# Altium project SUBBOARD-phase_leg_3p_2L.PrjPcb
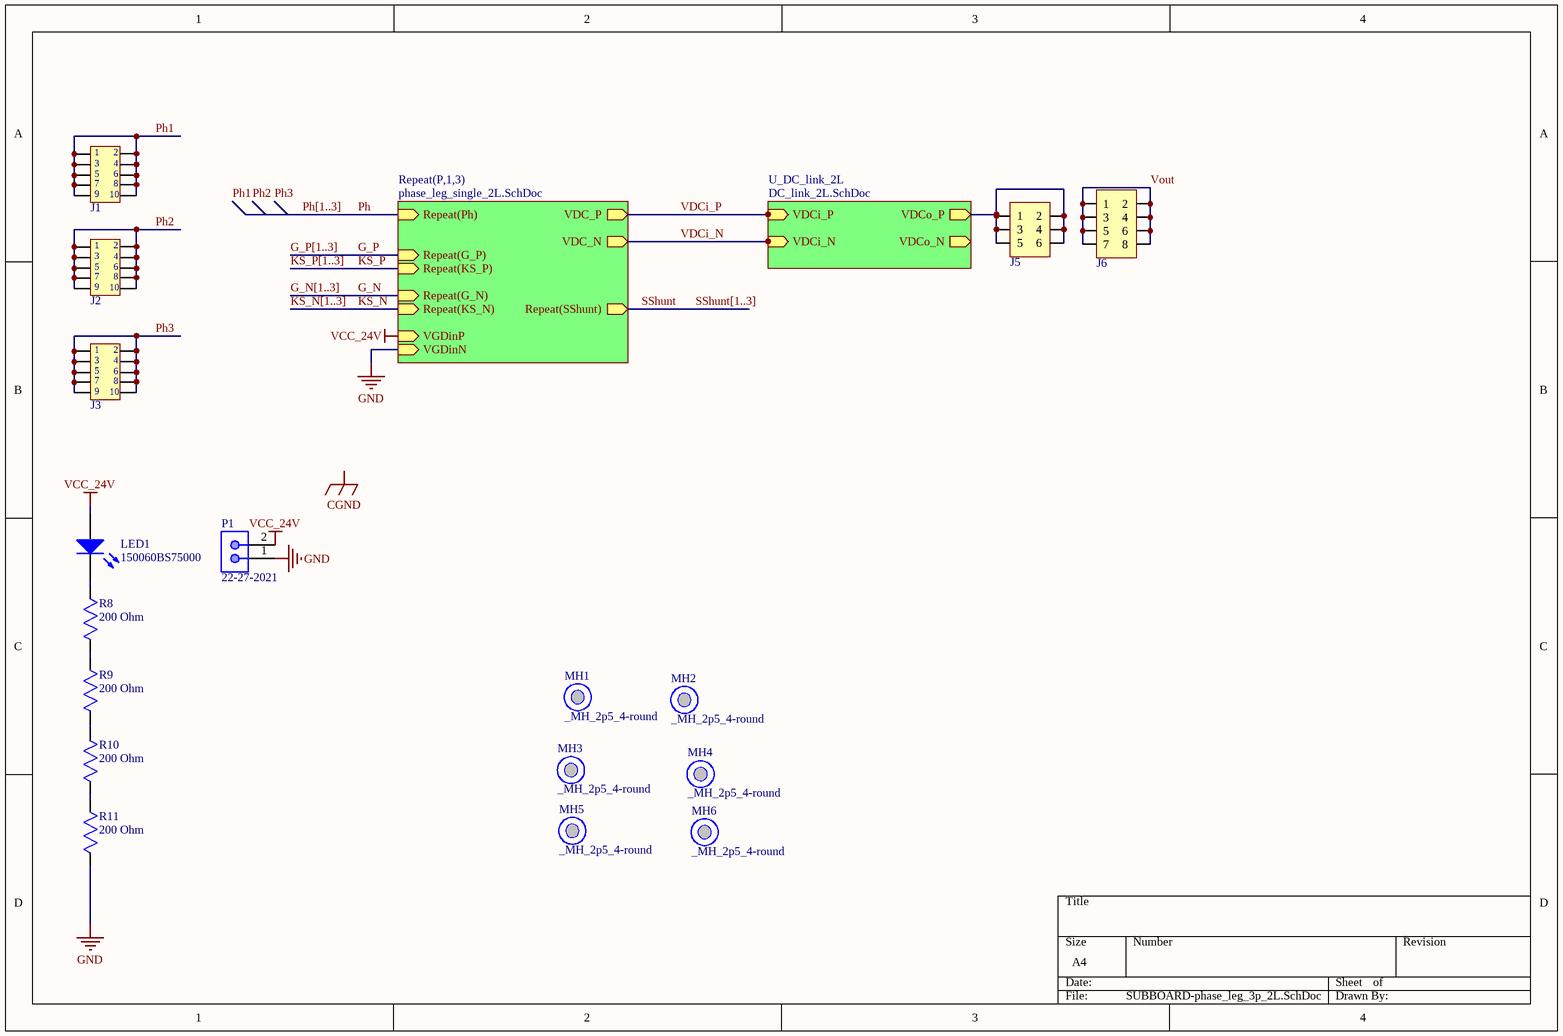
[diagram p0: SUBBOARD-phase_leg_3p_2L.SchDoc]
3 sheets, 86 parts. Net scope: hierarchical (ports join the sheet entries above them; power ports are global).
Board file: SUBBOARD-phase_leg_3p_2L.PcbDoc
Sheets:
  SUBBOARD-phase_leg_3p_2L.SchDoc
    U_DC_link_2L = DC_link_2L.SchDoc
    P1 = phase_leg_single_2L.SchDoc
    P2 = phase_leg_single_2L.SchDoc
    P3 = phase_leg_single_2L.SchDoc

## Sheet SUBBOARD-phase_leg_3p_2L.SchDoc
size A4

### Parts
J1  IPS1-105-01-L-D-RA  [IPS1-105-01-L-D-RA]  (value not drawn)
J2  IPS1-105-01-L-D-RA  [IPS1-105-01-L-D-RA]  (value not drawn)
J3  IPS1-105-01-L-D-RA  [IPS1-105-01-L-D-RA]  (value not drawn)
J5  SSW-103-01-G-D  [SSW-103-01-G-D]  (value not drawn)
J6  SSW-104-01-G-D  [SSW-104-01-G-D]  (value not drawn)
LED1  150060BS75000  [0603_A]
MH1  _MH_2p5_4-round  [_MH_2p5_4-round]
MH2  _MH_2p5_4-round  [_MH_2p5_4-round]
MH3  _MH_2p5_4-round  [_MH_2p5_4-round]
MH4  _MH_2p5_4-round  [_MH_2p5_4-round]
MH5  _MH_2p5_4-round  [_MH_2p5_4-round]
MH6  _MH_2p5_4-round  [_MH_2p5_4-round]
P1  22-27-2021  [MOLX-22-27-2021_V]
R8  200 Ohm  [CRCW0603200RFKEAHP]
R9  200 Ohm  [CRCW0603200RFKEAHP]
R10  200 Ohm  [CRCW0603200RFKEAHP]
R11  200 Ohm  [CRCW0603200RFKEAHP]

### Sub-sheets
Repeat(P,1,3) = phase_leg_single_2L.SchDoc: VDC_P (out), VDC_N (out), Repeat(Ph) (in), Repeat(G_P) (in), Repeat(KS_P) (in), Repeat(G_N) (in), Repeat(KS_N) (in), Repeat(SShunt) (out), VGDinP (in), VGDinN (in)
U_DC_link_2L = DC_link_2L.SchDoc: VDCo_P (out), VDCo_N (out), VDCi_P (in), VDCi_N (in)

### Nets
GND: P1.1 R11.2 ; sheet Repeat(P,1,3)/VGDinN
VCC_24V: LED1.2(A) P1.2 ; sheet Repeat(P,1,3)/VGDinP
G_N: sheet Repeat(P,1,3)/Repeat(G_N)
G_P: sheet Repeat(P,1,3)/Repeat(G_P)
KS_N: sheet Repeat(P,1,3)/Repeat(KS_N)
KS_P: sheet Repeat(P,1,3)/Repeat(KS_P)
Ph: sheet Repeat(P,1,3)/Repeat(Ph)
Ph1: J1.1 J1.2 J1.3 J1.4 J1.5 J1.6 J1.7 J1.8 J1.9 J1.10
Ph2: J2.1 J2.2 J2.3 J2.4 J2.5 J2.6 J2.7 J2.8 J2.9 J2.10
Ph3: J3.1 J3.2 J3.3 J3.4 J3.5 J3.6 J3.7 J3.8 J3.9 J3.10
SShunt: sheet Repeat(P,1,3)/Repeat(SShunt)
VDCi_N: sheet U_DC_link_2L/VDCo_N, sheet U_DC_link_2L/VDCi_N, sheet Repeat(P,1,3)/VDC_N
VDCi_P: J5.1 J5.2 J5.3 J5.4 J5.5 J5.6 ; sheet U_DC_link_2L/VDCo_P, sheet U_DC_link_2L/VDCi_P, sheet Repeat(P,1,3)/VDC_P
Vout: J6.1 J6.2 J6.3 J6.4 J6.5 J6.6 J6.7 J6.8
NetLED1_1: LED1.1(K) R8.1
NetR8_2: R8.2 R9.1
NetR9_2: R9.2 R10.1
NetR10_2: R10.2 R11.1

### Buses and harness runs
bus G_N[1..3]
bus G_P[1..3]
bus KS_N[1..3]
bus KS_P[1..3]
bus Ph[1..3]
bus SShunt[1..3]

### Notes on the sheet
- Labels drawn without touching a wire or pin: CGND, Ph1, Ph2, Ph3

### Library data of the parts
J1-J3 = IPS1-105-01-L-D-RA: SAMTEC         IPS1-105-01-L-D-RA             Board-To-Board Connector, Right Angle, IPS1 Series, 10 Contacts, Receptacle, 2.54 mm, Through Hole; Number of Contacts: 10; Number of Ports: 1; Max Voltage Rating (AC): 550V; Current Rating: 9A; Voltage Rating: 777V; Pitch: 2.54mm; Supplier 1: Digi-Key; Manufacturer: Samtec; Manufacturer Part Number: IPS1-105-01-L-D-RA; RoHS: Yes; Category: Connectors; Stock 1: 364; Pricing 1: 1=2.75000, 10=2.64000, 100=2.20000, 500=1.87000, 1000=1.59500, 5000=1.43000 (USD); Mount: Through Hole,Surface Mount; Number of Terminals: 10; Contact Material: Bronze; Contact Plating: Gold; Housing Material: Polymer; Min Operating Temperature: -55°C; Max Operating Temperature: 125°C; Termination: Solder; Orientation: Right Angle; Packaging: Bulk; Gender: Receptacle; Number of Rows: 2; Length: 13.08mm; Depth: 8.51mm; Radiation Hardening: No; REACH SVHC: No SVHC; ComponentLink1URL: https://datasheet.ciiva.com/25618/0900766b8114c2ed-25618027.pdf?src-supplier=RSComponents; ComponentLink1Description: https://datasheet.ciiva.com/25618/0900766b8114c2ed-25618027.pdf?src-supplier=RSComponents; ComponentLink2URL: https://datasheet.ciiva.com/9444/ipt1-9444586.pdf?src-supplier=Avnet; ComponentLink2Description: https://datasheet.ciiva.com/9444/ipt1-9444586.pdf?src-supplier=Avnet; Supplier Part Number 1: SAM9620-ND
J5 = SSW-103-01-G-D: Conn Socket Strip SKT 6 POS 2.54mm Solder ST Thru-Hole; Manufacturer: Samtec; Number of Contacts: 6; Gender: Receptacle; Connector Type: Receptacle,Socket; Contact Resistance: 10mR; Max Current Rating: 6.9A; Max Voltage Rating (AC): 550V; Mating Cycles: 100; Row Spacing: 0.1inch; Supplier 1: Digi-Key; Manufacturer Part Number: SSW-103-01-G-D; RoHS: Yes; Category: Headers and Wire Housings; Stock 1: 1397; Pricing 1: 1=0.93000, 10=0.82100, 25=0.77240, 50=0.74020, 100=0.70800, 250=0.64368, 500=0.57932 (USD); Mount: Through Hole; Contact Plating: Gold; Contact Material: Bronze; Color: Black; Housing Color: Black; Housing Material: Polymer; Min Operating Temperature: -55°C; Max Operating Temperature: 125°C; Number of Rows: 2; Termination: Solder; Packaging: Bulk; Number of Positions: 6; Orientation: Vertical; Current Rating: 6.9A; Voltage Rating: 550V; Length: 8.13mm; Pitch: 2.54mm; Depth: 4.95mm; Radiation Hardening: No; Lead Free: Lead Free; REACH SVHC: No SVHC; ComponentLink1URL: https://datasheet.ciiva.com/25617/0900766b8115c03d-25617399.pdf?src-supplier=RSComponents; ComponentLink1Description: https://datasheet.ciiva.com/25617/0900766b8115c03d-25617399.pdf?src-supplier=RSComponents; ComponentLink2URL: https://datasheet.ciiva.com/22677/82032-22677622.pdf?src-supplier=Element14; ComponentLink2Description: https://datasheet.ciiva.com/22677/82032-22677622.pdf?src-supplier=Element14; ComponentLink3URL: https://datasheet.ciiva.com/749/ssw-1xx-xx-xxx-x-xx-xxx-xx-mkt-749828.pdf?src-supplier=Digi-Key; ComponentLink3Description: https://datasheet.ciiva.com/749/ssw-1xx-xx-xxx-x-xx-xxx-xx-mkt-749828.pdf?src-supplier=Digi-Key; Supplier Part Number 1: SAM1208-03-ND; Supplier 2: Arrow; Stock 2: 1; Pricing 2: 1=0.94640, 1=0.93000, 4167=0.71590, 8334=0.59720, 41667=0.52200, 83334=0.49330 (USD); Supplier 3: Mouser; Stock 3: 388; Pricing 3: 1=1.35000, 10=1.10000, 100=0.98200, 250=0.91700, 500=0.79200, 1000=0.69000 (USD); Supplier Part Number 2: SSW-103-01-G-D; Supplier Part Number 3: 200-SSW10301GD
J6 = SSW-104-01-G-D: Conn Socket Strip SKT 8 POS 2.54mm Solder ST Thru-Hole; Manufacturer: Samtec; Number of Contacts: 8; Max Current Rating: 6.9A; Contact Resistance: 10mR; Max Voltage Rating (AC): 550V; Gender: Receptacle; Connector Type: Receptacle,Socket; Mating Cycles: 100; Row Spacing: 0.1inch; Supplier 1: Digi-Key; Manufacturer Part Number: SSW-104-01-G-D; RoHS: Yes; Category: Headers and Wire Housings; Stock 1: 1152; Pricing 1: 1=1.24000, 10=1.09400, 25=1.03000, 50=0.98700, 100=0.94410, 250=0.85824, 500=0.77242 (USD); Mount: Through Hole; Contact Plating: Gold; Contact Material: Bronze; Color: Black; Housing Color: Black; Housing Material: Polymer; Min Operating Temperature: -55°C; Max Operating Temperature: 125°C; Number of Rows: 2; Termination: Solder; Packaging: Bulk; Orientation: Vertical; Number of Positions: 8; Current Rating: 6.9A; Voltage Rating: 550V; Length: 10.67mm; Pitch: 2.54mm; Depth: 4.95mm; Radiation Hardening: No; Lead Free: Lead Free; REACH SVHC: No SVHC; ComponentLink1URL: https://datasheet.ciiva.com/25617/0900766b8115c03d-25617355.pdf?src-supplier=RSComponents; ComponentLink1Description: https://datasheet.ciiva.com/25617/0900766b8115c03d-25617355.pdf?src-supplier=RSComponents; ComponentLink2URL: https://datasheet.ciiva.com/22677/82032-22677624.pdf?src-supplier=Element14; ComponentLink2Description: https://datasheet.ciiva.com/22677/82032-22677624.pdf?src-supplier=Element14; ComponentLink3URL: https://datasheet.ciiva.com/749/ssw-1xx-xx-xxx-x-xx-xxx-xx-mkt-749827.pdf?src-supplier=Digi-Key; ComponentLink3Description: https://datasheet.ciiva.com/749/ssw-1xx-xx-xxx-x-xx-xxx-xx-mkt-749827.pdf?src-supplier=Digi-Key; Supplier Part Number 1: SAM1208-04-ND
LED1 = CMP-1426-00003-1: SMD mono-color Chip LED, WL-SMCW, Blue; Manufacturer: Wuerth Elektronik; Color: Blue; ComponentLink2Description: Datasheet; ComponentLink2URL: http://katalog.we-online.com/led/datasheet/150060BS75000.pdf; ComponentLink1URL: http://www.we-online.com; PackageReference: 0603_A; PartNumber: 150060BS75000; ComponentLink1Description: Manufacturer URL
MH1-MH6 = _MH_2p5_4-round: matching hole 2.5 hole, 4mm pad (round)
P1 = CMP-2000-05537-1: Male Header, Pitch 2.54 mm, 1 x 2 Position, Height 11.7 mm, Tail Length 3.56 mm, 0 to 75 degC, RoHS, Bulk; Manufacturer: Molex; PartNumber: 0022272021; Current rating: 4A; Package Version: Rev. BC, 02/2012; Voltage rating: 250V; No. of Positions: 2; Pitch: 2.54mm; No. of Rows: 1; Orientation: Vertical; Operating temperature: 0°Cto+75°C; Manufacturer URL: http://www.molex.com/; Mounting Technology: ThroughHole; Housing material: Nylon(UL94V-0); Package Description: 2-Leads Header, Body 5.08 x 5.8 mm, Pitch 2.54 mm; Voltage - Max: 250V; Datasheet URL: http://www.molex.com/pdm_docs/sd/022272021_sd.pdf; Package Reference: 22-27-2021; Contact material: Tinplatedbrass; Current - Max: 4A; Datasheet Version: Rev. F, 06/2009
R8-R11 = CRCW0603200RFKEAHP: CRCW0603200RFKEAHP / Res Thick Film 0603 200 Ohm 1% 0.25W(1/4W) ±100ppm/C Pad SMD Automotive T/R; Manufacturer: Vishay Dale; Resistance: 200R; Power Rating: 250mW; Temperature Coefficient: 100ppm/°C; Supplier 1: Digi-Key; Manufacturer Part Number: CRCW0603200RFKEAHP; RoHS: Yes; Category: Chip SMD Resistors; Stock 1: 59007; Pricing 1: 1=0.15000, 10=0.12900, 100=0.05030, 1000=0.02106, 2500=0.01930 (USD); Mount: Surface Mount; Case/Package: 0603; Case Code (Imperial): 0603; Case Code (Metric): 1608; Contact Plating: Tin; Min Operating Temperature: -55°C; Max Operating Temperature: 155°C; Features: Automotive AEC-Q200; Tolerance: 1%; Packaging: Tape and Reel; Resistor Type: Thick Film; Max Power Dissipation: 250mW; Number of Terminations: 2; Package Quantity: 5000; Length: 0.063inch; Width: 0.033inch; Height: 0.022inch; Radiation Hardening: No; Lead Free: Lead Free; ComponentLink1URL: https://datasheet.ciiva.com/2578/crcwhpe3-2578537.pdf?src-supplier=Digi-Key; ComponentLink1Description: https://datasheet.ciiva.com/2578/crcwhpe3-2578537.pdf?src-supplier=Digi-Key; ComponentLink2URL: https://datasheet.ciiva.com/8961/crcwhpe3-8961129.pdf?src-supplier=Avnet; ComponentLink2Description: https://datasheet.ciiva.com/8961/crcwhpe3-8961129.pdf?src-supplier=Avnet; Supplier Part Number 1: 541-200SCT-ND

## Sheet DC_link_2L.SchDoc
size A4
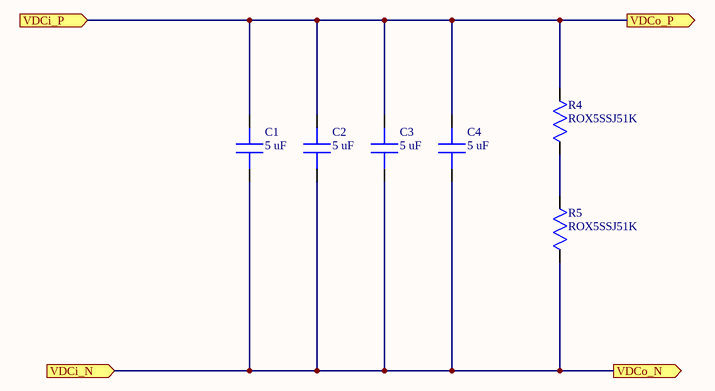
[diagram p1: DC_link_2L.SchDoc]

### Parts
C1  Capacitance: 5 uF  [MKP1848S55010JP4B]  (hidden comment: MKP1848S55010JP4B)
C2  Capacitance: 5 uF  [MKP1848S55010JP4B]  (hidden comment: MKP1848S55010JP4B)
C3  Capacitance: 5 uF  [MKP1848S55010JP4B]  (hidden comment: MKP1848S55010JP4B)
C4  Capacitance: 5 uF  [MKP1848S55010JP4B]  (hidden comment: MKP1848S55010JP4B)
R4  ROX5SSJ51K  [RES_ROX5SS]
R5  ROX5SSJ51K  [RES_ROX5SS]

### Ports
VDCi_N (in), VDCi_P (in), VDCo_N (out), VDCo_P (out)

### Nets
VDCi_N: C1.2 C2.2 C3.2 C4.2 R5.1 ; port VDCo_N, port VDCi_N
VDCi_P: C1.1 C2.1 C3.1 C4.1 R4.2 ; port VDCo_P, port VDCi_P
NetR4_1: R4.1 R5.2

### Library data of the parts
C1-C4 = MKP1848S55010JP4B: Film Capacitors 5uF 5% 1000volts 4pins 37.5mm LS; Manufacturer: Vishay; Voltage Rating DC: 1000 V; ESR: 11.5 mOhm; Tolerance: 5 %; Number of Pins: 4; Supplier 1: Mouser; Supplier Part Number 1: 75-MKP1848S55010JP4B
R4 R5 = ROX5SSJ51K: Metal Oxide Resistors 5W XSM M/OX 5% 51K; Manufacturer: TE Connectivity; Value: 51 kOhm; Manufacturer Part Number: ROX5SSJ51K; RoHS: No; Stock 1: 846; Pricing 1: 1=0,66000, 10=0,54900, 25=0,47080, 50=0,42360, 100=0,36880, 250=0,32952 (USD); Power: 5 W; Tolerance: 5 %; Length: 17.5 mm; Diameter: 6.5 mm; Supplier 1: Digi-Key; Supplier 2: Digi-Key; Supplier 3: RSComponents; Supplier 4: Mouser; Supplier 5: Farnell; Supplier Part Number 5: 3229952; Supplier Part Number 4: 279-ROX5SSJ51K; Supplier Part Number 3: 1869581; Supplier Part Number 2: A142841TB-ND; Supplier Part Number 1: A142841CT-ND

## Sheet phase_leg_single_2L.SchDoc
size A4
Used 3 times, as channels P1, P2, P3. Parts and nets are listed once, with the designators drawn on the sheet.
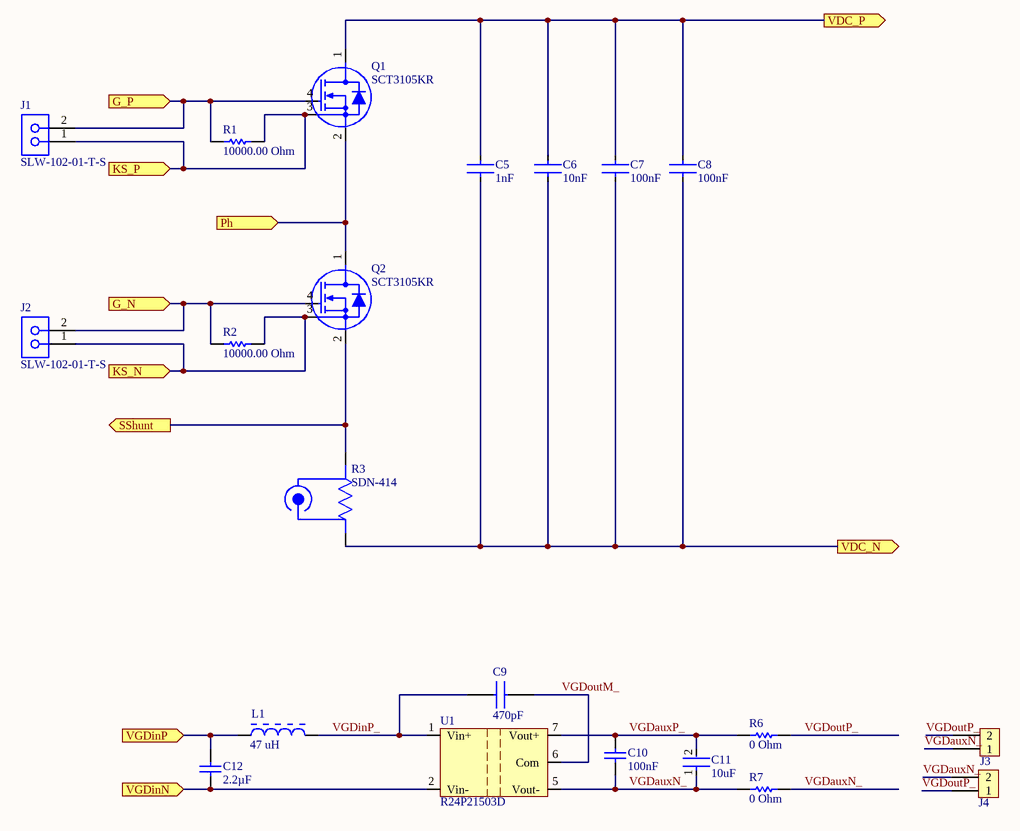
[diagram p2: phase_leg_single_2L.SchDoc]

### Parts
C5  Capacitance: 1nF  [C_2220_L_C2220C102JGGACTU]  (hidden comment: C2220C102JGGACTU)
C6  Capacitance: 10nF  [C_2220_L_C2220C103KDRACTU]  (hidden comment: C2220C103KDRACTU)
C7  Capacitance: 100nF  [C_2220_L_C2220C104KDRACTU]  (hidden comment: C2220C104KDRACTU)
C8  Capacitance: 100nF  [C_2220_L_C2220C104KDRACTU]  (hidden comment: C2220C104KDRACTU)
C9  Capacitance: 470pF  [885352211001]  (hidden comment: 885352211001)
C10  value 100nF  [CAPC0603(1608)100_L]  (hidden comment: CAP 100nF 50V 0603(1608))
C11  value 10uF  [FP-GRT31-0_2-MFG]  (hidden comment: GRT31CR61H106KE01L)
C12  Capacitance: 2.2µF  [CAPC2013X145X20LL20]  (hidden comment: C2012X7R1H225K125AC)
J1  SLW-102-01-T-S  [SMTC-SLW-102-01-X-S]
J2  SLW-102-01-T-S  [SMTC-SLW-102-01-X-S]
J3  SSM-102-L-SV  [SSM-102-L-SV]  (value not drawn)
J4  SSM-102-L-SV  [SSM-102-L-SV]  (value not drawn)
L1  Inductance: 47 uH  [BOUR-SRN3015-2_V]  (hidden comment: SRN3015-470M)
Q1  SCT3105KR  [TO-247-4L_hsa]
Q2  SCT3105KR  [TO-247-4L_hsa]
R1  value 10000.00 Ohm  [RESC0805(2012)_L]  (hidden comment: 10K 5% 0805(2012))
R2  value 10000.00 Ohm  [RESC0805(2012)_L]  (hidden comment: 10K 5% 0805(2012))
R3  SDN-414  [SDN-414]
R6  value 0 Ohm  [RESC2013X50X30LL20T20]  (hidden comment: CRCW08050000Z0EA)
R7  value 0 Ohm  [RESC2013X50X30LL20T20]  (hidden comment: CRCW08050000Z0EA)
U1  R24P21503D  [SIP-7_R05P22005D]

### Ports
G_N (in), G_P (in), KS_N (in), KS_P (in), Ph (in), SShunt (out), VDC_N (out), VDC_P (out), VGDinN (in), VGDinP (in)

### Nets
G_N: J2.2 Q2.4(G) R2.2 ; port G_N
G_P: J1.2 Q1.4(G) R1.1 ; port G_P
KS_N: J2.1 Q2.3(KS) R2.1 ; port KS_N
KS_P: J1.1 Q1.3(KS) R1.2 ; port KS_P
Ph: Q1.2(S) Q2.1(D) ; port Ph
SShunt: Q2.2(S) R3.1(-) ; port SShunt
VDC_N: C5.1 C6.1 C7.1 C8.1 R3.2(+) ; port VDC_N
VDC_P: C5.2 C6.2 C7.2 C8.2 Q1.1(D) ; port VDC_P
VGDauxN_: C10.1 C11.1 J3.1 J4.2 R7.1 R7.2 U1.5(Vout-)
VGDauxP_: C10.2 C11.2 R6.2 U1.7(Vout+)
VGDinN: C12.2 U1.2(Vin-) ; port VGDinN
VGDinP: C12.1 L1.1 ; port VGDinP
VGDinP_: C9.2 L1.2 U1.1(Vin+)
VGDoutM_: C9.1 U1.6(Com)
VGDoutP_: J3.2 J4.1 R6.1

### Channels
P1: designators end in _P1; ports G_N=G_N1 G_P=G_P1 KS_N=KS_N1 KS_P=KS_P1 Ph=Ph1 SShunt=SShunt1 VDC_N=VDCi_N VDC_P=VDCi_P VGDinN=GND VGDinP=VCC_24V
P2: designators end in _P2; ports G_N=G_N2 G_P=G_P2 KS_N=KS_N2 KS_P=KS_P2 Ph=Ph2 SShunt=SShunt2 VDC_N=VDCi_N VDC_P=VDCi_P VGDinN=GND VGDinP=VCC_24V
P3: designators end in _P3; ports G_N=G_N3 G_P=G_P3 KS_N=KS_N3 KS_P=KS_P3 Ph=Ph3 SShunt=SShunt3 VDC_N=VDCi_N VDC_P=VDCi_P VGDinN=GND VGDinP=VCC_24V

### Library data of the parts
C5 = C2220C102JGGACTU: KEMET - C2220C102JGGACTU - KONDENSATOR 1000PF 2 KV 5% C0G/NP0 2220; Dielectric Material: Ceramic; Voltage Rating (DC): 2kV; Dielectric: C0G; Temperature Coefficient: 30ppm/°C; Manufacturer: KEMET; Manufacturer Part Number: C2220C102JGGACTU; RoHS: Yes; Category: Ceramic Capacitors; Stock 1: 706; Pricing 1: 1=4,95000, 10=4,45600, 50=3,86220, 100=3,36710, 500=2,77292 (USD); Mount: Surface Mount; Case/Package: 2220; Case Code (Imperial): 2220; Case Code (Metric): 5750; Min Operating Temperature: -55°C; Max Operating Temperature: 125°C; Tolerance: 5%; Voltage Rating: 2kV; Packaging: Cut Tape; Package Quantity: 1; Length: 0.224inch; Thickness: 0.071inch; Depth: 5mm; Width: 0.197inch; Lead Free: Lead Free; REACH SVHC: No SVHC; ComponentLink1URL: https://datasheet.ciiva.com/5904/1698768-5904864.pdf?src-supplier=Farnell; ComponentLink1Description: https://datasheet.ciiva.com/5904/1698768-5904864.pdf?src-supplier=Farnell; ComponentLink2URL: https://datasheet.ciiva.com/7807/1698768-7807429.pdf?src-supplier=Element14; ComponentLink2Description: https://datasheet.ciiva.com/7807/1698768-7807429.pdf?src-supplier=Element14; ComponentLink3URL: https://datasheet.ciiva.com/7807/1698768-7807430.pdf?src-supplier=Element14; ComponentLink3Description: https://datasheet.ciiva.com/7807/1698768-7807430.pdf?src-supplier=Element14; Supplier 1: Digi-Key; Supplier 2: Digi-Key; Supplier 3: Newark; Supplier 4: Mouser; Supplier 5: Arrow; Supplier 6: Newark; Supplier 7: Farnell; Supplier Part Number 7: 1702176; Supplier Part Number 6: 67R5592; Supplier Part Number 5: C2220C102JGGACTU; Supplier Part Number 4: 80-C2220C102JGG; Supplier Part Number 3: 08R5595; Supplier Part Number 2: 399-7308-6-ND; Supplier Part Number 1: 399-7308-1-ND
C6 = C2220C103KDRACTU: Cap Ceramic 0.01uF 1000V X7R 10% SMD 2220 125C Plastic T/R; Manufacturer: KEMET; Voltage Rating: 1kV; Manufacturer Part Number: C2220C103KDRACTU; RoHS: Yes; Category: Ceramic Capacitors; Stock 1: 4957; Pricing 1: 1=4,39000, 10=3,54400, 50=3,04760, 100=2,76400, 500=2,05532 (USD); Mount: Surface Mount; Case/Package: 2220; Case Code (Imperial): 2220; Case Code (Metric): 5750; Dielectric Material: Ceramic; Min Operating Temperature: -55°C; Max Operating Temperature: 125°C; Dielectric: X7R; Package Quantity: 1; Tolerance: 10%; Packaging: Cut Tape; Voltage Rating (DC): 1kV; Length: 0.224inch; Height: 1.4mm; Thickness: 0.061inch; Depth: 5mm; Width: 0.197inch; REACH SVHC: No SVHC; ComponentLink1URL: https://datasheet.ciiva.com/7807/1499186-7807431.pdf?src-supplier=Element14; ComponentLink1Description: https://datasheet.ciiva.com/7807/1499186-7807431.pdf?src-supplier=Element14; ComponentLink2URL: https://datasheet.ciiva.com/7807/1499186-7807432.pdf?src-supplier=Element14; ComponentLink2Description: https://datasheet.ciiva.com/7807/1499186-7807432.pdf?src-supplier=Element14; Supplier 1: Digi-Key; Supplier 2: Digi-Key; Supplier 3: Digi-Key; Supplier 4: Newark; Supplier 5: Mouser; Supplier 6: Arrow; Supplier 7: Farnell; Supplier Part Number 7: 1702182; Supplier Part Number 6: C2220C103KDRACTU; Supplier Part Number 5: 80-C2220C103KDR; Supplier Part Number 4: 08R5596; Supplier Part Number 3: 399-7309-2-ND; Supplier Part Number 2: 399-7309-6-ND; Supplier Part Number 1: 399-7309-1-ND
C7 C8 = C2220C104KDRACTU: CAP CER 0.1UF 1KV X7R 2220; Manufacturer: KEMET; Dielectric Material: Ceramic; Tolerance: 10%; Manufacturer Part Number: C2220C104KDRACTU; RoHS: Yes; Category: Ceramic Capacitors; Stock 1: 1165; Pricing 1: 1=1,15000, 10=0,90600, 50=0,78500, 100=0,67940 (USD); Mount: Surface Mount; Case/Package: 2220; Case Code (Metric): 5750; Case Code (Imperial): 2220; Min Operating Temperature: -55°C; Max Operating Temperature: 125°C; Termination: SMD/SMT; Package Quantity: 500; Packaging: Tape and Reel; Voltage Rating: 1kV; Voltage Rating (DC): 1kV; Dielectric: X7R; Length: 0.224inch; Thickness: 0.087inch; Width: 0.197inch; ComponentLink1URL: http://www.farnell.com/datasheets/2316241.pdf?src-supplier=Farnell; ComponentLink1Description: http://www.farnell.com/datasheets/2316241.pdf?src-supplier=Farnell; ComponentLink2URL: http://www.mouser.com/ds/2/212/KEM_C1010_X7R_HV_SMD-345925.pdf?src-supplier=Mouser; ComponentLink2Description: http://www.mouser.com/ds/2/212/KEM_C1010_X7R_HV_SMD-345925.pdf?src-supplier=Mouser; ComponentLink3URL: http://www.kemet.com/docfinder?Partnumber=C2220C104KDRACTU&src-supplier=Digi-Key; ComponentLink3Description: http://www.kemet.com/docfinder?Partnumber=C2220C104KDRACTU&src-supplier=Digi-Key; ComponentLink4URL: https://api.kemet.com/component-edge/download/datasheet/C2220C104KDRACTU.pdf?src-supplier=Digi-Key; ComponentLink4Description: https://api.kemet.com/component-edge/download/datasheet/C2220C104KDRACTU.pdf?src-supplier=Digi-Key; ComponentLink5URL: http://www.kemet.com/Lists/ProductCatalog/Attachments/53/KEM_C1002_X7R_SMD.pdf?src-supplier=Avnet; ComponentLink5Description: http://www.kemet.com/Lists/ProductCatalog/Attachments/53/KEM_C1002_X7R_SMD.pdf?src-supplier=Avnet; Supplier 1: Digi-Key; Supplier 2: Digi-Key; Supplier 3: Digi-Key; Supplier 4: Avnet; Supplier 5: Mouser; Supplier 6: Newark; Supplier 7: Arrow; Supplier 8: Farnell; Supplier Part Number 1: 399-10490-1-ND; Supplier Part Number 2: 399-10490-6-ND; Supplier Part Number 3: 399-10490-2-ND; Supplier Part Number 4: C2220C104KDRACTU; Supplier Part Number 5: 80-C2220C104KDR; Supplier Part Number 6: 05AC8309; Supplier Part Number 7: C2220C104KDRACTU; Supplier Part Number 8: 2676644
C9 = 885352211001: CAP CER 470PF 250VAC X7R 1812; Manufacturer: Wurth Electronics; Tolerance: 10%; Ratings: X1,Y2; Manufacturer Part Number: 885352211001; RoHS: Yes; Category: Ceramic Capacitors; Stock 1: 1066; Pricing 1: 1=0,74000, 25=0,73600, 50=0,60400, 100=0,51200, 250=0,43700, 500=0,36700 (USD); Mount: Surface Mount; Case/Package: 1812; Case Code (Imperial): 1812; Case Code (Metric): 4532; Min Operating Temperature: -55°C; Max Operating Temperature: 125°C; Packaging: Cut Tape; Length: 0.177inch; Width: 0.125inch; Thickness: 0.071inch; ComponentLink1URL: https://katalog.we-online.de/pbs/datasheet/885352211001.pdf?src-supplier=Digi-Key; ComponentLink1Description: https://katalog.we-online.de/pbs/datasheet/885352211001.pdf?src-supplier=Digi-Key; Supplier 1: Mouser; Supplier 2: Digi-Key; Supplier 3: Digi-Key; Supplier 4: Digi-Key; Supplier Part Number 2: 732-8853522110011CT-ND; Supplier Part Number 3: 732-8853522110011DKR-ND; Supplier Part Number 4: 732-8853522110011TR-ND; Supplier Part Number 1: 710-885352211001
C10 = CMP-1035-02591-1: CAP 100nF 50V ±5% 0603 (1608 Metric) Thickness 1mm SMD; Tolerance: Â±5%; Case-Metric: 1608; Case-EIA: 0603; Rated Voltage: 50 V; Max Thickness: 1 mm; Technology: SMT
C11 = CMP-06035-000076-1: CAP CER 10UF 50V X5R 1206; Manufacturer: Murata; Temperature Coefficient: 15%; Tolerance: 10%; Material: Ceramic; Automotive Grade: Grade 3; Height: 1.8mm; Ipc Land Pattern Name: CAPC320160X160; Octopart: https://octopart.com/grt31cr61h106ke01l-murata-62921736; Digikey Description: CAP CER 10UF 50V X5R 1206; Voltage Rating: 50V; Device Class L3: Ceramic Capacitors; ComponentLink2URL: https://search.murata.co.jp/Ceramy/image/img/A01X/G101/ENG/GRT31CR61H106KE01-01.pdf; Device Class L1: Passive Components; Temperature Range High: +85°C; Lead Free: Yes; Capacitance: 10uF; Manufacturer Part Number: GRT31CR61H106KE01L; Temperature Range Low: -55°C; Temperature Characteristic: X5R; Category: Cap; Automotive: Yes; ComponentLink2Description: Datasheet; Device Class L2: Capacitors; Package: GRT31-0.2; RoHS: TRUE; Temperature: -55°C to +85°C
C12 = CMP-2000-06040-1: Chip Capacitor, 2.2 uF, +/- 10%, 50 V, -55 to 125 degC, 0805 (2012 Metric), RoHS, Tape and Reel; Manufacturer: TDK; PCN Part Number: MLCCPartNumberChange30/Nov/2012; Other Names: 445-5968-1; Temperature Coefficient: X7R; Catalog Drawings: CSERIES_2012-0805_1.45; Kits: 445-9015-KIT-ND-KITMLCC1000PF-47UF080510-50V445-9003-KIT-ND-KITCAPCERHICAPMLCCSMD445-173086-KIT-ND-C0402-2220X7R6.3-50V1,000PF-; Online Catalog: CSeries,GeneralPurpose; Voltage - Rated: 50V; Product Training Modules: CSeriesGeneralApplicationsSEAT,CCV,andTVCLDesignToolsGuidetoReplacinganElectrolyticCapacitorwithanMLCC; Operating Temperature: -55°C~125°C; Features: -; Tolerance: ±10%; Datasheet URL: https://datasheet.ciiva.com/24216/c2012x7r1h225k125ac-265016-24216364.pdf; Lead Style: -; Size / Dimension: 0.079"Lx0.049"W(2.00mmx1.25mm); Mounting Technology: SurfaceMount; Package Reference: 0805; Thickness (Max): 0.057"(1.45mm); RoHS Information: RoHSCertificate-MLCC; Height - Seated (Max): -; Manufacturer URL: http://www.tdk.com/; Standard Package: 1; Category: Capacitors; Package Description: 2-Pin Surface Mount Device, Body 2 x 1.25 mm; Packaging: CutTape(CT); Series: C; Applications: GeneralPurpose; Package / Case: 0805(2012Metric); Ratings: -; Datasheet Version: 09/2013; Family: CeramicCapacitors; Mounting Type: SurfaceMount,MLCC; Lead Spacing: -
J1 J2 = CMP-1023-00124-1: Low Profile Socket Strips, Through-hole, Vertical, -55 to 105 degC, 2.54 mm Pitch, 2-Pin, Female, RoHS; Manufacturer: Samtec; Pitch: 2.54 mm; System: Connector; ComponentLink2Description: Datasheet; PackageReference: SLW-102-01-X-S; Orientation: Vertical; PartNumber: SLW-102-01-T-S; ComponentLink3URL: http://www.samtec.com/documents/webfiles/cpdf/SLW-1XX-01-X-X-MKT.pdf; DatasheetVersion: F-214; Mounting Technology: Through-hole; ComponentLink3Description: Package Specification; ComponentLink2URL: http://www.samtec.com/documents/webfiles/pdf/SLW.PDF; PackageDescription: Low Profile Socket Strip; Temperature Range: -55 to 105 degC; ComponentLink1Description: Manufacturer URL; PackageVersion: X, 9/1987; RoHS: True; ComponentLink1URL: http://www.samtec.com
J3 J4 = SSM-102-L-SV: SAMTEC - SSM-102-L-SV - RECEPTACLE, 2.54MM, VERT, 2WAY; Number of Contacts: 2; Contact Resistance: 10mR; Max Voltage Rating (AC): 475V; Max Current Rating: 6.9A; Connector Type: Receptacle,Socket; System: Connector; Supplier 1: Digi-Key; Manufacturer: Samtec; Manufacturer Part Number: SSM-102-L-SV; RoHS: Yes; Category: Headers and Wire Housings; Stock 1: 51; Pricing 1: 1=0.56000, 10=0.52100, 25=0.46920, 50=0.41700, 100=0.39960, 250=0.36488, 500=0.34752 (USD); Mount: Surface Mount; Contact Plating: Gold; Contact Material: Bronze; Housing Material: Polymer; Housing Color: Black; Color: Black; Min Operating Temperature: -55°C; Max Operating Temperature: 125°C; Termination: Solder; Number of Rows: 1; Packaging: Bulk; Gender: Receptacle; Orientation: Straight; Current Rating: 6.9A; Number of Positions: 2; Voltage Rating: 475V; Voltage Rating (AC): 475V; Length: 5.08mm; Pitch: 2.54mm; Depth: 2.54mm; Lead Pitch: 2.54mm; Radiation Hardening: No; Lead Free: Lead Free; REACH SVHC: No SVHC; ComponentLink1URL: https://datasheet.ciiva.com/25617/0900766b811594ab-25617394.pdf?src-supplier=RSComponents; ComponentLink1Description: https://datasheet.ciiva.com/25617/0900766b811594ab-25617394.pdf?src-supplier=RSComponents; ComponentLink2URL: https://datasheet.ciiva.com/746/ssm-1xx-xxx-xx-xx-xx-x-xx-xx-mkt-746741.pdf?src-supplier=Digi-Key; ComponentLink2Description: https://datasheet.ciiva.com/746/ssm-1xx-xxx-xx-xx-xx-x-xx-xx-mkt-746741.pdf?src-supplier=Digi-Key; ComponentLink3URL: https://datasheet.ciiva.com/22677/81944-22677814.pdf?src-supplier=Element14; ComponentLink3Description: https://datasheet.ciiva.com/22677/81944-22677814.pdf?src-supplier=Element14; Supplier Part Number 1: SAM1148-02-ND; Supplier 2: Arrow; Stock 2: 1; Pricing 2: 1=0.53350, 1=0.47880, 12500=0.42240, 25000=0.36600, 125000=0.31770, 250000=0.29990 (USD); Supplier 3: Mouser; Stock 3: 175; Pricing 3: 1=0.92000, 10=0.73100, 100=0.63600, 500=0.57200, 1000=0.50800, 2500=0.44500 (USD); Supplier Part Number 2: SSM-102-L-SV; Supplier Part Number 3: 200-SSM102LSV
L1 = CMP-0007-00006-1: Semi-shielded Power Inductor, 47 uH, +/- 20%, 0.4 A, -40 to 125 degC, 3 x 3 x 1.5 mm SMD, RoHS and Halogen Free, Tape and Reel; Manufacturer: Bourns; DCR Max: 1.406 Ohm; Isat: 0.38 A; Rated current: 0.4 A; Inductance tolerance: +/- 20%; SRF Min: 18 MHz; Resistance to Solder Heat: +260 degC for 10 sec.; ComponentLink1URL: http://www.bourns.com/; ComponentLink1Description: Manufacturer URL; ComponentLink2Description: Datasheet; PackageDescription: 2-Pin SMD, Body 3 x 3 mm, Height 1.5 mm; Packing: Tape and Reel; PackageReference: SRN3015; Mounting Technology: Surface Mount; DatasheetVersion: Aug-11; RoHS: TRUE; ComponentLink3URL: http://www.bourns.com/data/global/pdfs/SRN3015.pdf; PartNumber: SRN3015-470M; ComponentLink2URL: http://www.bourns.com/data/global/pdfs/SRN3015.pdf; Operating Temperature: -40 to 125 degC; ComponentLink3Description: Package Specification
Q1 Q2 = SCT3105KR: N-channel SiC power MOSFET ROHM. Vdss 1200V, Rdson 105mOhm, Id 24A; Rds on @ Id, Vgs: 137 mOhm; Drive Voltage: 18 V; Gate Charge (Qg) (Max) @ Vds: 51 nC; Vgs Max: +22 V / -4 V; Input Capacitance (Ciss) (Max) @ Vds: 574pF @ 800V; Supplier 1: Mouser; Supplier 2: Digi-Key; Supplier 3: Farnell; Supplier 4: Newark; Supplier Part Number 4: 34AH2699; Supplier Part Number 3: 3241766; Supplier Part Number 2: 846-SCT3105KRC14-ND; Supplier Part Number 1: 755-SCT3105KRC14; FET type: N-Channel; Technology: SiC-FET; Drain-to-source voltage (Vdss): 1200 V; Current - continuous drain (Id) @ 25°C: 24 A; Package/Case: TO-247-4
R1 R2 = CMP-1013-00098-1: 10K 0.125W 5% 0805 (2012 Metric)  SMD; Case-EIA: 0805; Case-Metric: 2012; Power: 0.125 W; Technology: SMT; Tolerance: 5 %
R3 = SDN-414: Coaxial current shunt SDN-414 T&M (New); Manufacturer: Ohmite; Manufacturer Part Number: WHE10RFET; Resistance: 10R; Power Rating: 5W; Tolerance: 1%; Temperature Coefficient: 50ppm/°C; Lead Diameter: 1mm; Supplier 1: Digi-Key; RoHS: Yes; Category: Through-Hole Resistors; Stock 1: 228; Pricing 1: 1=1.54000, 10=1.36400, 25=1.25400, 50=1.14400, 100=0.99000, 250=0.83600 (USD); Case/Package: Axial; Number of Pins: 2; Weight: 0.080848oz; Min Operating Temperature: -55°C; Max Operating Temperature: 150°C; Number of Terminations: 2; Termination: Axial; Package Quantity: 500; Packaging: Tape and Reel; Composition: Wirewound; Max Power Dissipation: 5W; Diameter: 7.5mm; Length: 20mm; REACH SVHC: Unknown; ComponentLink1URL: https://datasheet.ciiva.com/5635/res-wh-wn-5635598.pdf?src-supplier=Mouser; ComponentLink1Description: https://datasheet.ciiva.com/5635/res-wh-wn-5635598.pdf?src-supplier=Mouser; ComponentLink2URL: https://datasheet.ciiva.com/6495/res-wh-wn-6495224.pdf?src-supplier=Digi-Key; ComponentLink2Description: https://datasheet.ciiva.com/6495/res-wh-wn-6495224.pdf?src-supplier=Digi-Key; ComponentLink3URL: https://datasheet.ciiva.com/6495/res-wh-wn-6495226.pdf?src-supplier=Digi-Key; ComponentLink3Description: https://datasheet.ciiva.com/6495/res-wh-wn-6495226.pdf?src-supplier=Digi-Key; Supplier Part Number 1: WHE10RFETCT-ND
R6 R7 = CMP-2001-04896-1: Manufacturer: Vishay Dale; Part Number: CRCW08050000Z0EA
U1 = R24P21503D: 2W DC/DC-Converter 'ECONOLINE' SIP7 6.4kV unreg; V. In: 24; V. Out: +15/-03; mA. Out: +93/-185; Manufacturer: Recom; Max Output Voltage: 15V; Manufacturer Part Number: R24P21503D; RoHS: No; Category: Voltage Regulators - Switching; Stock 1: 358; Pricing 1: 1=8,88000, 5=8,71200, 10=8,64500, 25=8,51200, 50=8,24600, 100=7,61000, 250=7,31500, 500=7,18200 (USD); Weight: 4.3g; Length: 19.5mm; Height: 12.5mm; Width: 9.8mm; Supplier 1: Digi-Key; Supplier 2: RSComponents; Supplier 3: Mouser; Supplier 4: Future Electronics; Supplier 5: Arrow Electronics; Supplier 6: Newark; Supplier Part Number 6: 22AC6462; Supplier Part Number 5: R24P21503D; Supplier Part Number 4: R24P21503D-TUBE; Supplier Part Number 3: 919-R24P21503D; Supplier Part Number 2: 1446041; Supplier Part Number 1: 945-3071-5-ND

## Nets that join several sheets
GND: SUBBOARD-phase_leg_3p_2L (P1.1 R11.2), P1 (C12_P1.2 U1_P1.2), P2 (C12_P2.2 U1_P2.2), P3 (C12_P3.2 U1_P3.2)
VCC_24V: SUBBOARD-phase_leg_3p_2L (LED1.2 P1.2), P1 (C12_P1.1 L1_P1.1), P2 (C12_P2.1 L1_P2.1), P3 (C12_P3.1 L1_P3.1)
Ph1: SUBBOARD-phase_leg_3p_2L (10 pins), P1 (Q1_P1.2 Q2_P1.1)
Ph2: SUBBOARD-phase_leg_3p_2L (10 pins), P2 (Q1_P2.2 Q2_P2.1)
Ph3: SUBBOARD-phase_leg_3p_2L (10 pins), P3 (Q1_P3.2 Q2_P3.1)
VDCi_N: DC_link_2L (5 pins), P1 (5 pins), P2 (5 pins), P3 (5 pins)
VDCi_P: SUBBOARD-phase_leg_3p_2L (6 pins), DC_link_2L (5 pins), P1 (5 pins), P2 (5 pins), P3 (5 pins)